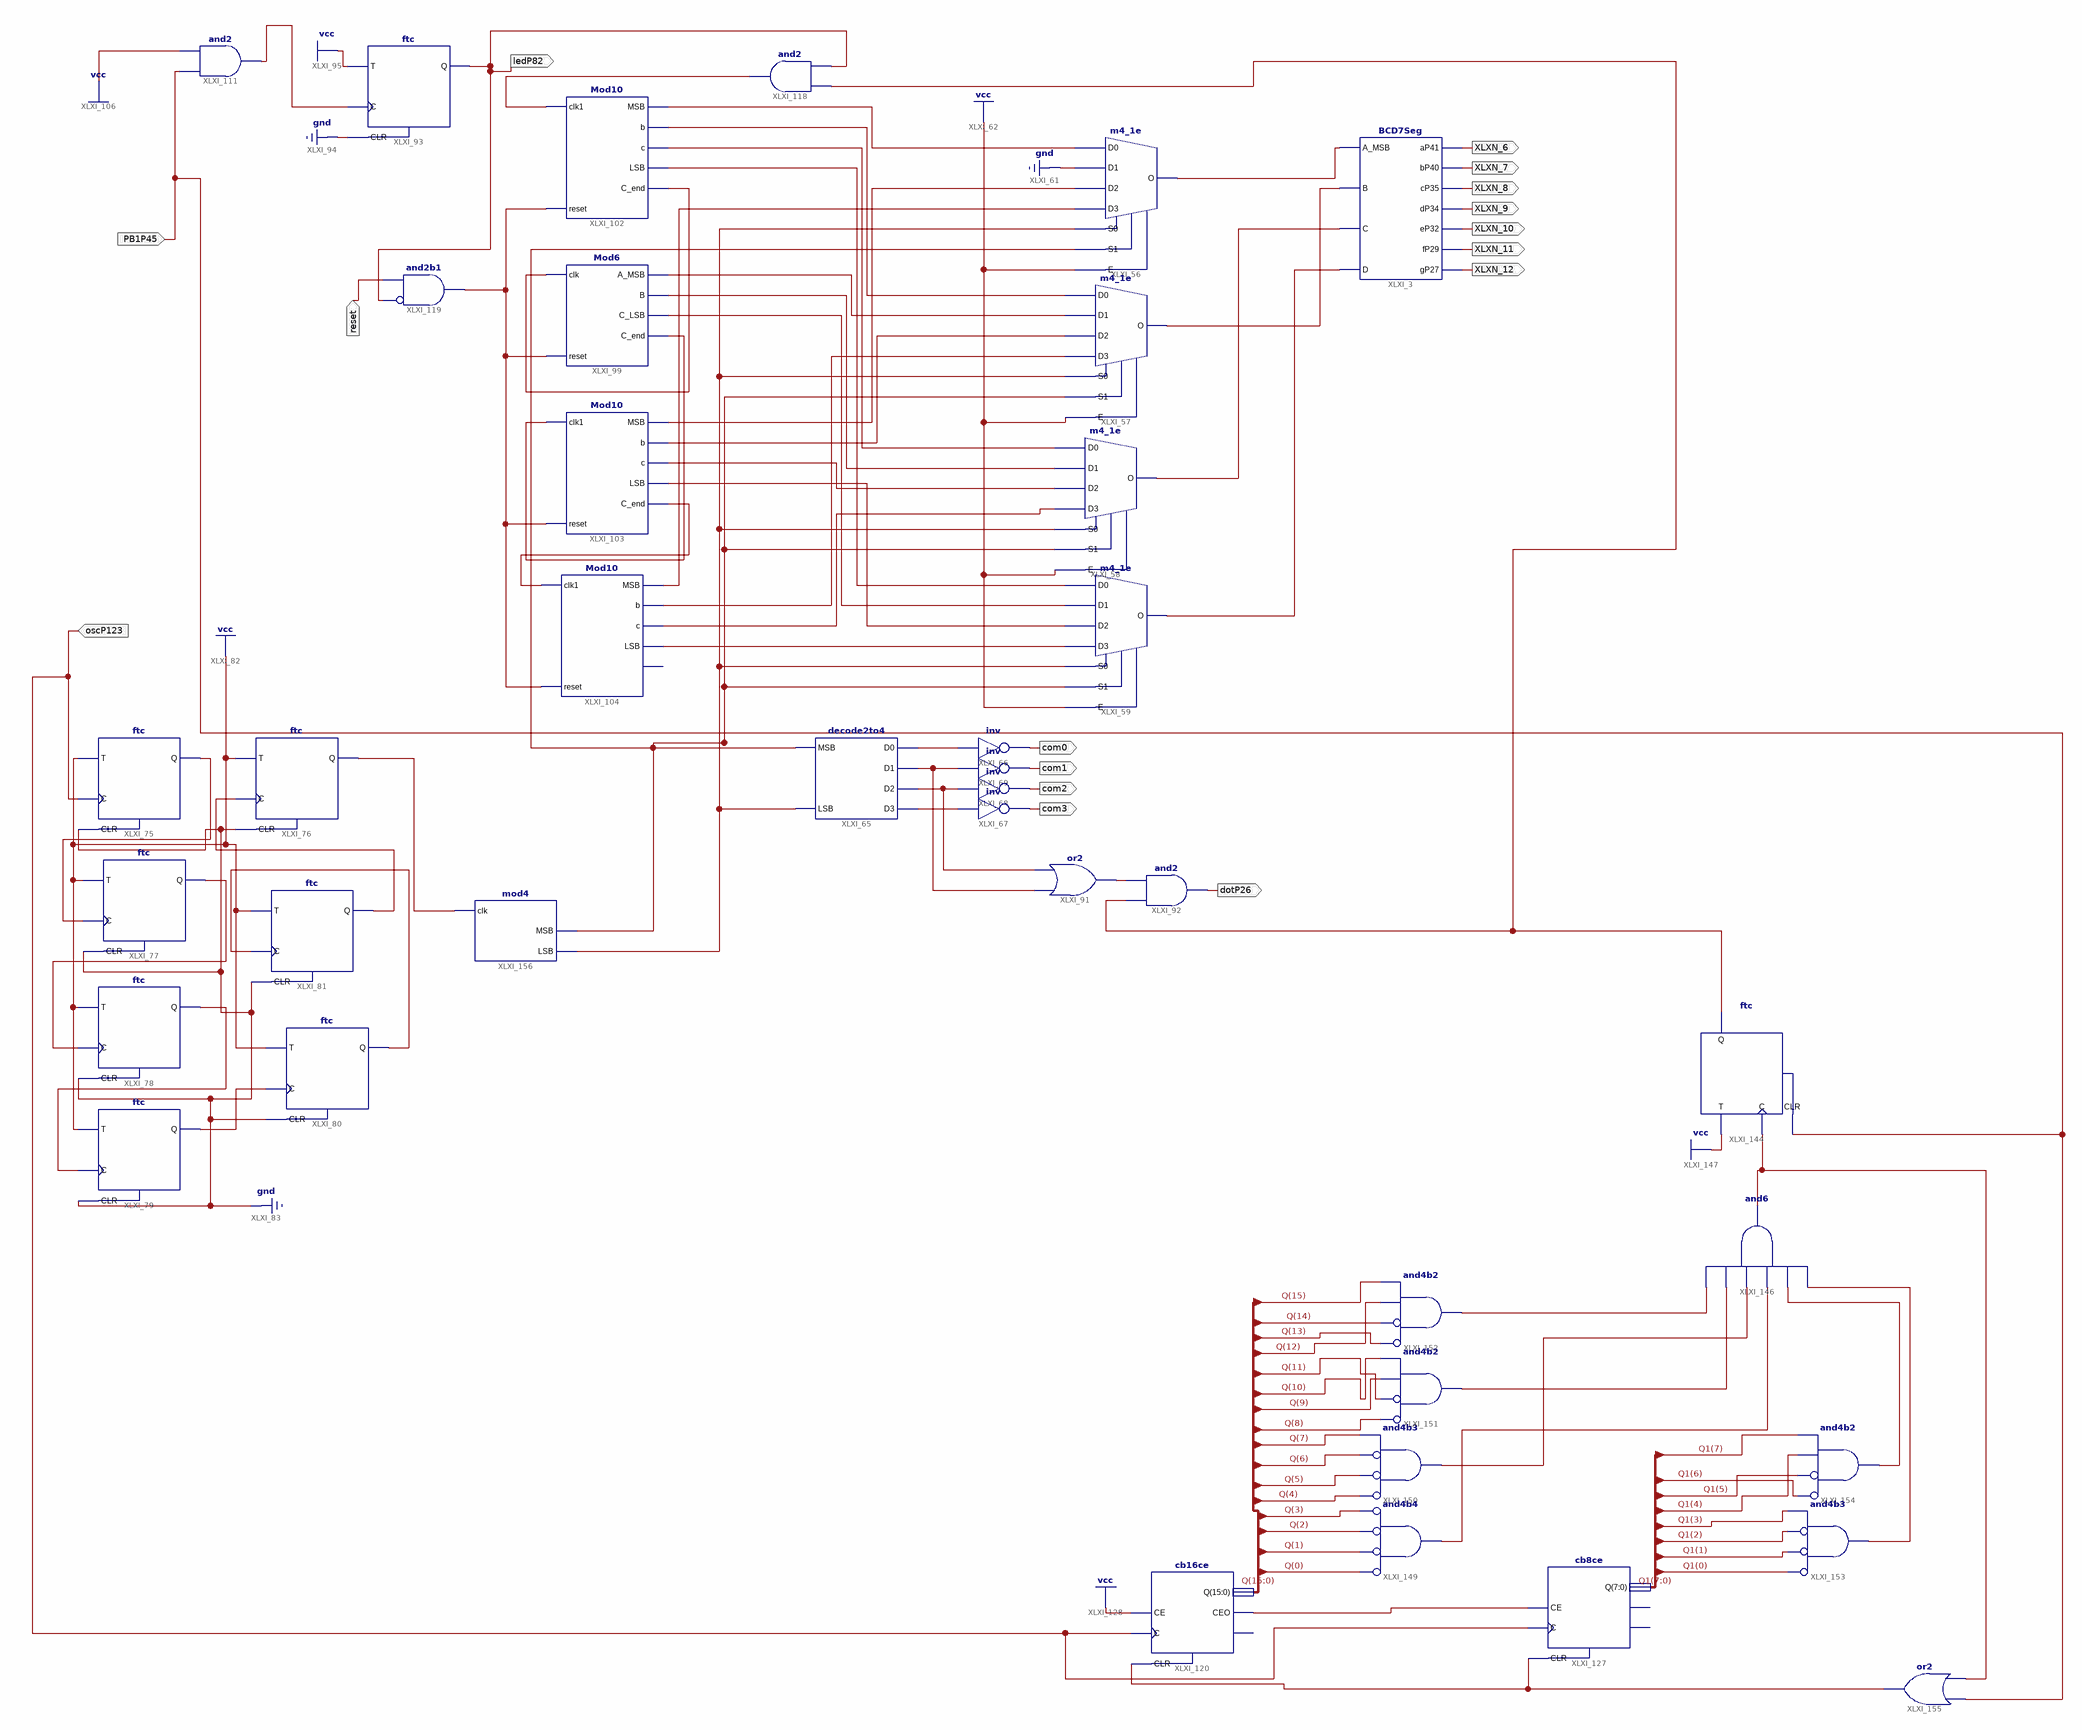
[diagram p0: schematic sheet 1]
// Xilinx ISE schematic lab7.sch (spartan6) as structural Verilog: 39 symbols, 16 ports
module lab7 (
  input  PB1P45,
  input  reset,
  input  oscP123,
  output XLXN_6,
  output XLXN_7,
  output XLXN_8,
  output XLXN_9,
  output XLXN_10,
  output XLXN_11,
  output XLXN_12,
  output com0,
  output com3,
  output com2,
  output com1,
  output dotP26,
  output ledP82
);

  wire XLXN_119, XLXN_123, XLXN_132, XLXN_135, XLXN_167, XLXN_168, XLXN_169, XLXN_170, XLXN_171, XLXN_172,
       XLXN_173, XLXN_191, XLXN_194, XLXN_197, XLXN_228, XLXN_265, XLXN_302, XLXN_306, XLXN_313, XLXN_314,
       XLXN_315, XLXN_316, XLXN_318, XLXN_319, XLXN_320, XLXN_321, XLXN_322, XLXN_323, XLXN_324, XLXN_326,
       XLXN_327, XLXN_328, XLXN_329, XLXN_335, XLXN_336, XLXN_338, XLXN_339, XLXN_351, XLXN_390, XLXN_454,
       XLXN_456, XLXN_458, XLXN_479, XLXN_485, XLXN_490, XLXN_492, XLXN_498, XLXN_499, XLXN_501;
  wire [7:0] Q1;
  wire [15:0] Q;

  BCD7Seg XLXI_3 (
    .A_MSB(XLXN_119), .B(XLXN_123), .C(XLXN_265), .D(XLXN_228), .aP41(XLXN_6), .bP40(XLXN_7), .cP35(XLXN_8),
    .dP34(XLXN_9), .eP32(XLXN_10), .fP29(XLXN_11), .gP27(XLXN_12));
  m4_1e XLXI_56 (
    .D0(XLXN_306), .D1(1'b0), .D2(XLXN_320), .D3(XLXN_327), .E(1'b1), .S0(XLXN_335), .S1(XLXN_329),
    .O(XLXN_119));
  m4_1e XLXI_57 (
    .D0(XLXN_313), .D1(XLXN_316), .D2(XLXN_321), .D3(XLXN_326), .E(1'b1), .S0(XLXN_335), .S1(XLXN_329),
    .O(XLXN_123));
  m4_1e XLXI_58 (
    .D0(XLXN_314), .D1(XLXN_318), .D2(XLXN_322), .D3(XLXN_328), .E(1'b1), .S0(XLXN_335), .S1(XLXN_329),
    .O(XLXN_265));
  m4_1e XLXI_59 (
    .D0(XLXN_315), .D1(XLXN_319), .D2(XLXN_323), .D3(XLXN_324), .E(1'b1), .S0(XLXN_335), .S1(XLXN_329),
    .O(XLXN_228));
  ftc XLXI_75 (.C(oscP123), .CLR(1'b0), .T(1'b1), .Q(XLXN_167));
  ftc XLXI_76 (.C(XLXN_172), .CLR(1'b0), .T(1'b1), .Q(XLXN_173));
  ftc XLXI_77 (.C(XLXN_167), .CLR(1'b0), .T(1'b1), .Q(XLXN_168));
  ftc XLXI_78 (.C(XLXN_168), .CLR(1'b0), .T(1'b1), .Q(XLXN_169));
  ftc XLXI_79 (.C(XLXN_169), .CLR(1'b0), .T(1'b1), .Q(XLXN_170));
  ftc XLXI_80 (.C(XLXN_170), .CLR(1'b0), .T(1'b1), .Q(XLXN_171));
  ftc XLXI_81 (.C(XLXN_171), .CLR(1'b0), .T(1'b1), .Q(XLXN_172));
  ftc XLXI_93 (.C(XLXN_351), .CLR(1'b0), .T(1'b1), .Q(ledP82));
  Mod6 XLXI_99 (.clk(XLXN_336), .reset(XLXN_302), .C_LSB(XLXN_319), .A_MSB(XLXN_316), .B(XLXN_318), .C_end(XLXN_338));
  not XLXI_68 (com2, XLXN_194);
  not XLXI_69 (com1, XLXN_191);
  not XLXI_66 (com0, XLXN_135);
  not XLXI_67 (com3, XLXN_132);
  and XLXI_92 (dotP26, XLXN_479, XLXN_197);
  or XLXI_91 (XLXN_197, XLXN_191, XLXN_194);
  decode2to4 XLXI_65 (.D0(XLXN_135), .D1(XLXN_191), .D2(XLXN_194), .D3(XLXN_132), .MSB(XLXN_329), .LSB(XLXN_335));
  Mod10 XLXI_102 (
    .clk1(XLXN_390), .reset(XLXN_302), .C_end(XLXN_336), .MSB(XLXN_306), .b(XLXN_313), .c(XLXN_314),
    .LSB(XLXN_315));
  Mod10 XLXI_103 (
    .clk1(XLXN_338), .reset(XLXN_302), .C_end(XLXN_339), .MSB(XLXN_320), .b(XLXN_321), .c(XLXN_322),
    .LSB(XLXN_323));
  Mod10 XLXI_104 (
    .clk1(XLXN_339), .reset(XLXN_302), .MSB(XLXN_327), .b(XLXN_326), .c(XLXN_328), .LSB(XLXN_324));  // open: C_end
  and XLXI_111 (XLXN_351, PB1P45, 1'b1);
  and XLXI_118 (XLXN_390, ledP82, XLXN_479);
  and XLXI_119 (XLXN_302, ~ledP82, reset);  // and2b1
  cb16ce XLXI_120 (.C(oscP123), .CE(1'b1), .CLR(XLXN_501), .CEO(XLXN_499), .Q(Q));  // open: TC
  cb8ce XLXI_127 (.C(oscP123), .CE(XLXN_499), .CLR(XLXN_501), .Q(Q1));  // open: CEO, TC
  ftc XLXI_144 (.C(XLXN_498), .CLR(PB1P45), .T(1'b1), .Q(XLXN_479));
  and XLXI_146 (XLXN_498, XLXN_492, XLXN_490, XLXN_456, XLXN_458, XLXN_454, XLXN_485);
  and XLXI_149 (XLXN_456, ~Q[0], ~Q[1], ~Q[2], ~Q[3]);  // and4b4
  and XLXI_150 (XLXN_458, ~Q[4], ~Q[5], ~Q[6], Q[7]);  // and4b3
  and XLXI_151 (XLXN_454, ~Q[8], ~Q[11], Q[9], Q[10]);  // and4b2
  and XLXI_152 (XLXN_485, ~Q[13], ~Q[14], Q[12], Q[15]);  // and4b2
  and XLXI_153 (XLXN_492, ~Q1[0], ~Q1[1], ~Q1[2], Q1[3]);  // and4b3
  and XLXI_154 (XLXN_490, ~Q1[6], ~Q1[5], Q1[4], Q1[7]);  // and4b2
  or XLXI_155 (XLXN_501, XLXN_498, PB1P45);
  mod4 XLXI_156 (.clk(XLXN_173), .MSB(XLXN_329), .LSB(XLXN_335));
endmodule
